# EAGLE design LB_BIT_i2_TOGGLESWITCH-v02(rev1) (EAGLE 6.6.0)
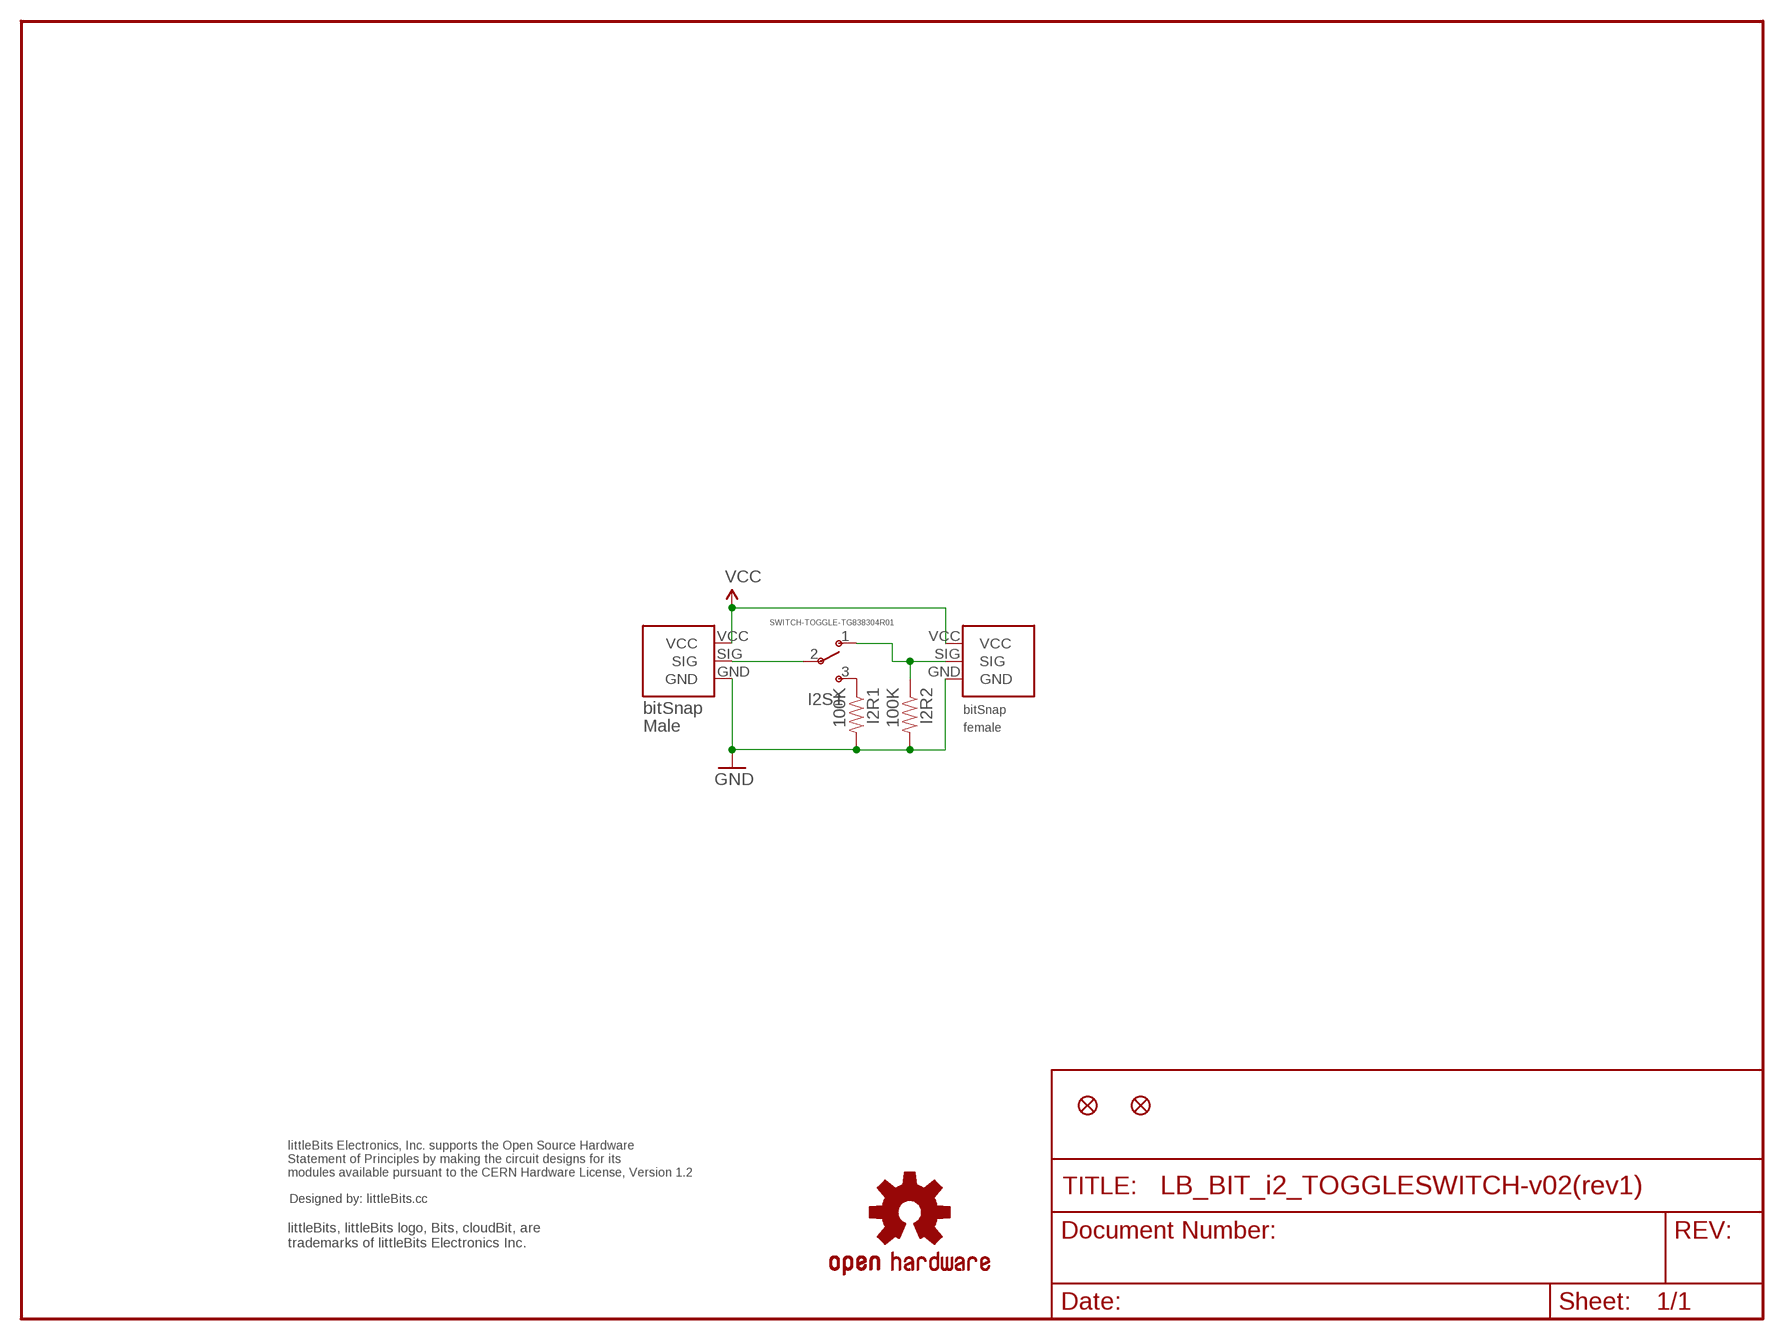
[diagram p0: schematic, sheet 1]

## Parts
I2BSF  BITSNAP_FEMALE  [BITSNAP_FEMALE]
I2BSM  BITSNAP_MALE  [BITSNAP_MALE]
I2R1  100K  RESISTOR0603-RES  [0603-RES]
I2R2  100K  RESISTOR0603-RES  [0603-RES]
I2S1  SWITCH-TOGGLE-TG838304R01  [SWITCH-TOGGLE-TG838304R01]
JP1  FIDUCIAL1X2  [FIDUCIAL-1X2]
JP2  FIDUCIAL1X2  [FIDUCIAL-1X2]
U$4  OSHWCREDIT  [OSHWCREDIT]
U$7  OSHW-LOGOL  [OSHW-LOGO-L]

## Nets
GND: I2BSF.GND I2BSM.GND I2R1.2 I2R2.2
N$2: I2R1.1 I2S1.3(S)
N$3: I2BSM.SIG I2S1.2(P)
N$4: I2BSF.SIG I2R2.1 I2S1.1(O)
VCC: I2BSF.VCC I2BSM.VCC

## Library data of the parts
I2BSF = bitSnap:BITSNAP_FEMALE
I2BSM = bitSnap:BITSNAP_MALE
I2R1 I2R2 = SparkFun:RESISTOR: Resistor Basic schematic elements and footprints for 0603, 1206, and PTH 1/10th watt (small) resistors.
I2S1 = LITTLEBITS:SWITCH-TOGGLE-TG838304R01
JP1 JP2 = SparkFun:FIDUCIAL: Fiducial Alignment Points Various fiducial points for machine vision alignment.
U$4 = LITTLEBITS:OSHWCREDIT
U$7 = SparkFun_NEW:OSHW-LOGO: Open Source Hardware Logo This logo indicates the piece of hardware it is found on incorporates a OSHW license and/or adheres to the definition of open source hardware found here: http://freedomdefined.org/OSHW

## Board
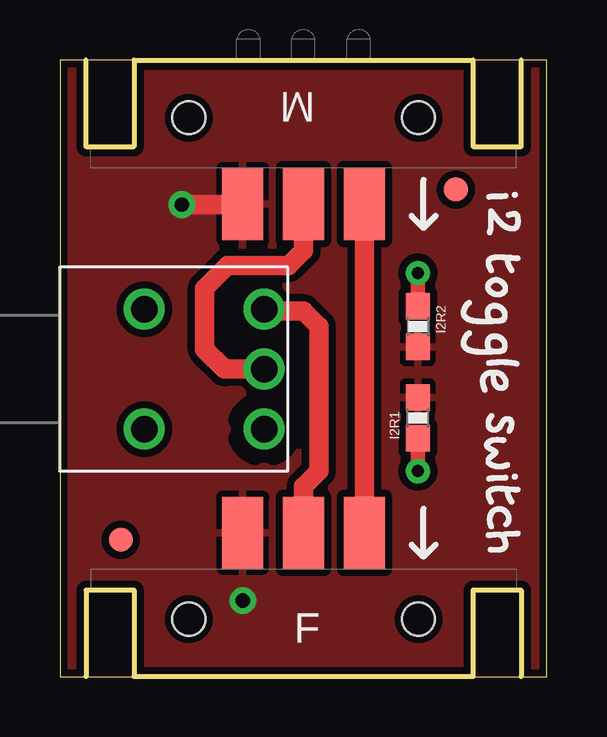
[diagram p1: board, top side]
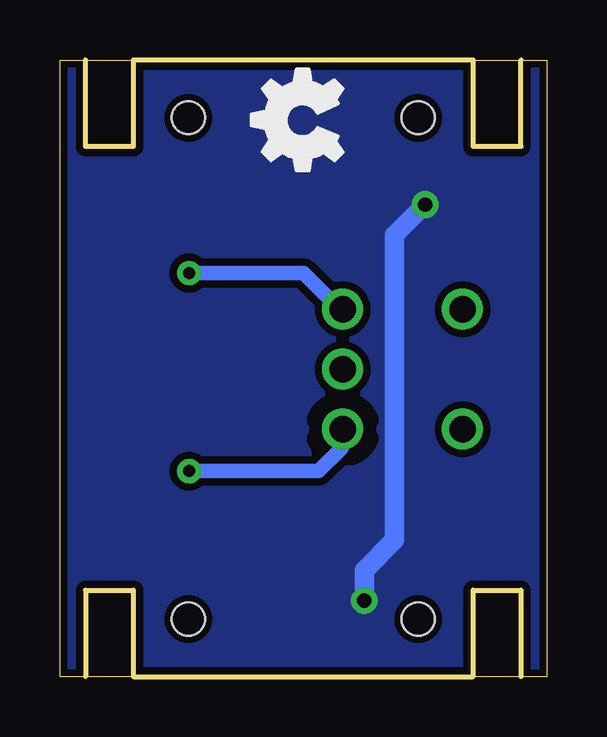
[diagram p2: board, bottom side, seen from below]

Size 20.31 x 25.72 mm. Coordinates in mm from the lower left corner, seen from the top.
Outline: 0,0 20.31,0 20.31,25.71 0,25.71 0,0
Copper layers (1*16): Top 0.035mm / dielectric 1.5mm / Bottom 0.035mm
Design rules "default": minimum track width 8mil, minimum drill 20mil, track to track 8mil, track to pad 8mil, pad to pad 8mil, via to via 8mil, smd to smd 8mil, copper to edge 10mil, drill to drill 8mil, minimum pad ring 12mil, minimum via ring 10mil, stop-mask expansion 4mil, vias tented up to drill 25mil, thermal gap 10mil

### Footprints (pad centres in the part's own frame; a part is rotated, then mirrored left to right if it is on the bottom)
BITSNAP_FEMALE = smd 1.7 x 3: GND 6.35,6; SIG 8.89,6; VCC 11.43,6 | hole 1.37: 13.68,2.41; 4.1,2.41
BITSNAP_MALE = smd 1.7 x 3: GND 11.43,6; SIG 8.89,6; VCC 6.35,6 | hole 1.37: 13.68,2.41; 4.1,2.41
0603-RES = smd 1.1 x 1: 1 -0.85,0; 2 0.85,0
SWITCH-TOGGLE-TG838304R01 = drill 1.1: 1 8.52,6.75; 2 8.52,4.25; 3 8.52,1.75; P$1 3.52,1.75; P$2 3.52,6.75
FIDUCIAL-1X2 = smd 1 x 1: 1 0,0

### Placement (x,y rotation side)
I2BSF  1.27,0 0 top
I2BSM  19.05,25.72 180 top
I2R1  14.92,10.79 90 top
I2R2  14.92,14.61 270 top
I2S1  0,8.57 0 top
JP1  2.54,5.71 0 top
JP2  16.51,20.32 0 top
U$1  [I]  17.65,20.32 270 top
U$2  [2]  17.65,19.68 270 top
U$3  [T]  17.65,17.78 270 top
U$4  -11.43,-22.86 0 top  (outside the outline)
U$6  [OSHW_FILLX150_NOTEXT]  8.51,20.26 0 top
U$7  -6.35,-10.16 0 top  (outside the outline)
U$22  [O]  17.65,16.83 270 top
U$23  [G]  16.7,15.88 270 top
U$24  [G]  16.7,14.61 270 top
U$25  [L]  17.65,13.34 270 top
U$26  [E]  17.34,13.02 270 top
U$27  [S]  17.65,11.11 270 top
U$28  [W]  17.65,10.16 270 top
U$29  [I]  17.65,8.57 270 top
U$30  [T]  17.65,8.13 270 top
U$31  [C]  17.65,7.24 270 top
U$32  [H]  17.53,6.1 270 top

### Tracks (layer width: path | path; a pad name or v marks a point on that pad's centre or on a via)
GND  (via drill 0.6)
  Top 0.813: v5.08,19.68 7.59,19.68 I2BSM.GND
  Bottom 0.813: v7.62,3.17 7.62,4.45 6.35,5.71 6.35,18.41 v5.08,19.68
  pour Top (isolate 0.305): 0.32,25.72 20,25.72 20,0 0.32,0
  pour Bottom (isolate 0.305): 0.32,25.72 20,25.72 20,0.32 0.32,0.32
N$2  (via drill 0.5)
  Top 0.61: I2R1.1 v14.92,8.57
  Bottom 0.61: v14.92,8.57 9.53,8.57 8.57,9.53 8.57,10.27 I2S1.3
N$3
  Top 0.813: I2S1.2 6.86,12.82 6.03,13.65 6.03,16.19 6.99,17.14 9.53,17.14 10.16,17.78 I2BSM.SIG
N$4  (via drill 0.5)
  Top 0.61: I2R2.1 v14.92,16.83
  Top 0.813: I2S1.1 8.6,15.24 10.16,15.24 10.79,14.61 10.79,8.57 10.16,7.94 I2BSF.SIG
  Bottom 0.61: v14.92,16.83 10.16,16.83 8.57,15.24 8.57,15.27 I2S1.1
VCC
  Top 0.813: I2BSF.VCC I2BSM.VCC